# EAGLE design Atrix_adapter (EAGLE 7.2.0)
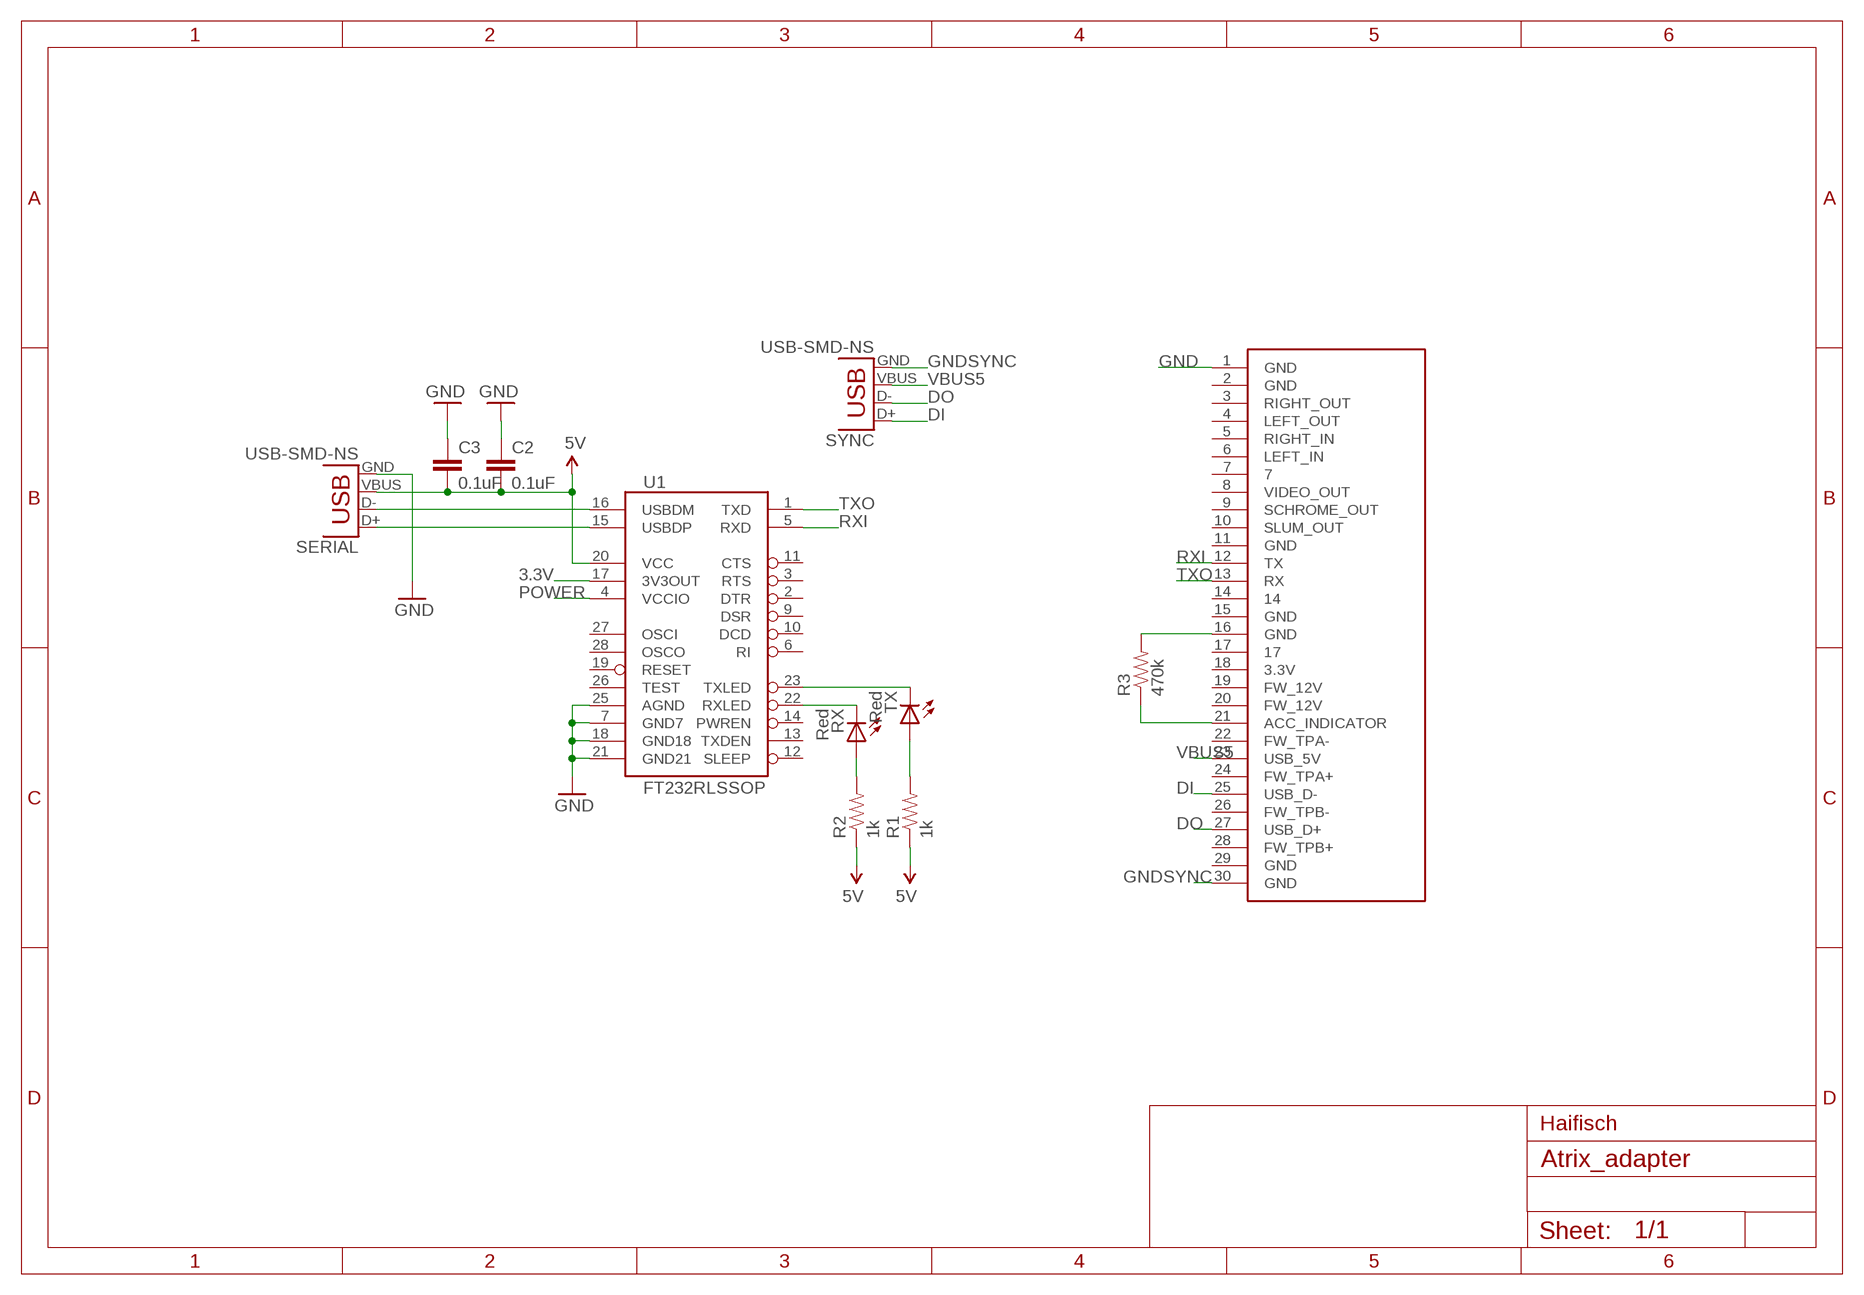
[diagram p0: schematic, sheet 1]

## Parts
C2  0.1uF  CAP0402-CAP  [0402-CAP]
C3  0.1uF  CAP0402-CAP  [0402-CAP]
R1  1k  RESISTOR0402-RES  [0402-RES]
R2  1k  RESISTOR0402-RES  [0402-RES]
R3  470k  RESISTOR0402-RES  [0402-RES]
RX  Red  LEDCHIP-LED0603  [CHIP-LED0603]
SERIAL  USB-SMD-NS  [USB-MINIB-NOSTOP]
SYNC  USB-SMD-NS  [USB-MINIB-NOSTOP]
TX  Red  LEDCHIP-LED0603  [CHIP-LED0603]
U1  FT232RLSSOP  [SSOP28DB]
U$1  IPOD_CONNECTOR_MALE  [IPOD_MALE_CONNECTOR]

## Nets
3.3V: U1.17(3V3OUT)
5V: C2.2 C3.2 R1.1 R2.1 SERIAL.VBUS U1.20(VCC)
DI: SYNC.D+ U$1.25(USB_D-)
DO: SYNC.D- U$1.27(USB_D+)
GND [power]: C2.1 C3.1 SERIAL.GND U1.7(GND7) U1.18(GND18) U1.21(GND21) U1.25(AGND) U$1.1(GND)
GNDSYNC: SYNC.GND U$1.30(GND)
N$1: R3.1 U$1.21(ACC_INDICATOR)
N$2: R3.2 U$1.16(GND)
N$9: SERIAL.D+ U1.15(USBDP)
N$10: SERIAL.D- U1.16(USBDM)
N$11: R2.2 RX.A
N$12: R1.2 TX.A
POWER: U1.4(VCCIO)
RXI: U1.5(RXD) U$1.12(TX)
RXLED: RX.C U1.22(RXLED)
TXLED: TX.C U1.23(TXLED)
TXO: U1.1(TXD) U$1.13(RX)
VBUS5: SYNC.VBUS U$1.23(USB_5V)
Unconnected: U1.2(DTR) U1.3(RTS) U1.6(RI) U1.9(DSR) U1.10(DCD) U1.11(CTS) U1.12(SLEEP) U1.13(TXDEN) U1.14(PWREN) U1.19(RESET) U1.26(TEST) U1.27(OSCI) U1.28(OSCO) U$1.2(GND) U$1.3(RIGHT_OUT) U$1.4(LEFT_OUT) U$1.5(RIGHT_IN) U$1.6(LEFT_IN) U$1.7 U$1.8(VIDEO_OUT) U$1.9(SCHROME_OUT) U$1.10(SLUM_OUT) U$1.11(GND) U$1.14 U$1.15(GND) U$1.17 U$1.18(3.3V) U$1.19(FW_12V) U$1.20(FW_12V) U$1.22(FW_TPA-) U$1.24(FW_TPA+) U$1.26(FW_TPB-) U$1.28(FW_TPB+) U$1.29(GND)

## Notes on the sheet
- Haifisch

## Library data of the parts
C2 C3 = Pinoccio:CAP: Capacitor Standard 0603 ceramic capacitor, and 0.1" leaded capacitor.
R1-R3 = Pinoccio:RESISTOR: Resistor Basic schematic elements and footprints for 0603, 1206, and PTH resistors.
RX TX = led:LED: LED OSRAM: - CHIPLED LG R971, LG N971, LY N971, LG Q971, LY Q971, LO R971, LY R971 LH N974, LH R974 LS Q976, LO Q976, LY Q976 LO Q996 - Hyper CHIPLED LW Q18S LB Q993, LB Q99A, LB R99A - SideLED LS A670, LO A670, LY A670, LG A670, LP A670 LB A673, LV A673, LT A673, LW A673 LH A674 LY A675 LS A676, LA A676, LO A676, LY A676, LW A676 LS A679, LY A679, LG A679 - Hyper Micro SIDELED® LS Y876, LA Y876, LO Y876, LY Y876 LT Y87S - SmartLED LW L88C, LW L88S LB L89C, LB L89S, LG L890 LS L89K, LO L89K, LY L89K LS L896, LA L896, LO L896, LY L896 - TOPLED LS T670, LO T670, LY T670, LG T670, LP T670 LSG T670, LSP T670, LSY T670, LOP T670, LYG T670 LG T671, LOG T671, LSG T671 LB T673, LV T673, LT T673, LW T673 LH T674 LS T676, LA T676, LO T676, LY T676, LB T676, LH T676, LSB T676, LW T676 LB T67C, LV T67C, LT T67C, LS T67K, LO T67K, LY T67K, LW E67C LS E67B, LA E67B, LO E67B, LY E67B, LB E67C, LV E67C, LT E67C LW T67C LS T679, LY T679, LG T679 LS T770, LO T770, LY T770, LG T770, LP T770 LB T773, LV T773, LT T773, LW T773 LH T774 LS E675, LA E675, LY E675, LS T675 LS T776, LA T776, LO T776, LY T776, LB T776 LHGB T686 LT T68C, LB T68C - Hyper Mini TOPLED® LB M676 - Mini TOPLED Santana® LG M470 LS M47K, LO M47K, LY M47K Source: http://www.osram.convergy.de LUXEON: - LUMILED® LXK2-PW12-R00, LXK2-PW12-S00, LXK2-PW14-U00, LXK2-PW14-V00 LXK2-PM12-R00, LXK2-PM12-S00, LXK2-PM14-U00 LXK2-PE12-Q00, LXK2-PE12-R00, LXK2-PE12-S00, LXK2-PE14-T00, LXK2-PE14-U00 LXK2-PB12-K00, LXK2-PB12-L00, LXK2-PB12-M00, LXK2-PB14-N00, LXK2-PB14-P00, LXK2-PB14-Q00 LXK2-PR12-L00, LXK2-PR12-M00, LXK2-PR14-Q00, LXK2-PR14-R00 LXK2-PD12-Q00, LXK2-PD12-R00, LXK2-PD12-S00 LXK2-PH12-R00, LXK2-PH12-S00 LXK2-PL12-P00, LXK2-PL12-Q00, LXK2-PL12-R00 Source: www.luxeon.com KINGBRIGHT: KA-3528ASYC Source: www.kingbright.com
SERIAL SYNC = SparkFun-Connectors:USB: USB Connectors USB-B-PTH is fully proven SKU : PRT-00139/CONN-08278 USB-miniB is fully proven SKU : PRT-00587 USB-A-PCB is untested. USB-A-H is throughly reviewed, but untested. Spark Fun Electronics SKU : PRT-00437 USB-B-SMT is throughly reviewed, but untested. Needs silkscreen touching up. USB-A-S has not been used/tested USB-MB-H has not been used/tested USB-MICROB has been used. CONN-09505
U1 = SparkFun-DigitalIC:FT232RL: USB UART FT232RL 4th Generation USB UART (USB <-> Serial) Controller. Spark Fun Electronics SKU : COM-00650 Production SKU IC-00870; PROD_ID: IC-00870
U$1 = SparkFun-Connectors:IPOD_CONNECTOR_MALE: iPod Male Connector This is the connector that will insert into an iPods. Use this connector to gain access to the various iPod pins. Schematic and footprint are not yet production proven. The PCB thickness must be more thin than the standard 0.062" FR4. Spark Fun Electronics SKU : DEV-00633

## Net classes
1 power: width 0.254 mm

## Board
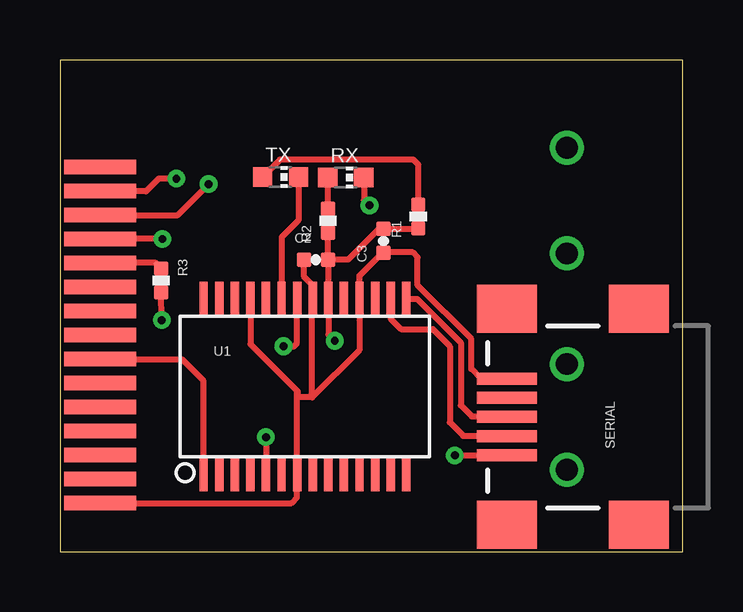
[diagram p1: board, top side]
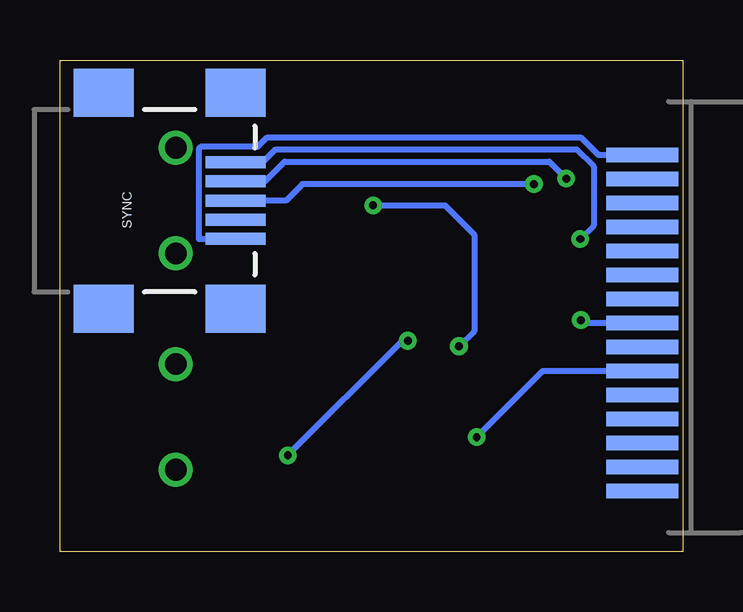
[diagram p2: board, bottom side, seen from below]

Size 25.96 x 20.5 mm. Coordinates in mm from the lower left corner, seen from the top.
Outline: 0,0 25.96,0 25.96,20.5 0,20.5 0,0
Copper layers (1*16): Top 0.035mm / dielectric 1.5mm / Bottom 0.035mm
Design rules "default": minimum track width 10mil, minimum drill 24mil, track to track 8mil, track to pad 8mil, pad to pad 8mil, via to via 8mil, smd to smd 8mil, copper to edge 40mil, drill to drill 8mil, minimum pad ring 10mil, minimum via ring 8mil, stop-mask expansion 4mil, vias tented up to drill 0mil, thermal gap 10mil

### Footprints (pad centres in the part's own frame; a part is rotated, then mirrored left to right if it is on the bottom)
0402-CAP = smd 0.6 x 0.6: 1 -0.5,0; 2 0.5,0
0402-RES = smd 0.6 x 0.6: 1 -0.5,0; 2 0.5,0
CHIP-LED0603 = smd 0.8 x 0.8: A 0,-0.75; C 0,0.75
USB-MINIB-NOSTOP = smd 2.5 x 0.5: D+ 2.5,0; D- 2.5,0.8; GND 2.5,-1.6; ID 2.5,-0.8; VBUS 2.5,1.6 | smd 2.5 x 2: G1 -3,-4.5; G2 -3,4.5; G3 2.5,4.5; G4 2.5,-4.5 | drill 0.9 pad 0.8: H1 0,2.2 | drill 0.9 pad 0.787: H2 0,-2.2
SSOP28DB = smd 0.348 x 1.397: 1 -4.225,-3.656; 2 -3.575,-3.656; 3 -2.925,-3.656; 4 -2.275,-3.656; 5 -1.625,-3.656; 6 -0.975,-3.656; 7 -0.325,-3.656; 8 0.325,-3.656; 9 0.975,-3.656; 10 1.625,-3.656; 11 2.275,-3.656; 12 2.925,-3.656; 13 3.575,-3.656; 14 4.225,-3.656; 15 4.225,3.656; 16 3.575,3.656; 17 2.925,3.656; 18 2.275,3.656; 19 1.625,3.656; 20 0.975,3.656; 21 0.325,3.656; 22 -0.325,3.656; 23 -0.975,3.656; 24 -1.625,3.656; 25 -2.275,3.656; 26 -2.925,3.656; 27 -3.575,3.656; 28 -4.225,3.656
IPOD_MALE_CONNECTOR = smd 0.6 x 3 bottom: 1 7.5,0; 3 6.5,0; 5 5.5,0; 7 4.5,0; 9 3.5,0; 11 2.5,0; 13 1.5,0; 15 0.5,0; 17 -0.5,0; 19 -1.5,0; 21 -2.5,0; 23 -3.5,0; 25 -4.5,0; 27 -5.5,0; 29 -6.5,0 | smd 0.6 x 3: 2 7,0; 4 6,0; 6 5,0; 8 4,0; 10 3,0; 12 2,0; 14 1,0; 16 0,0; 18 -1,0; 20 -2,0; 22 -3,0; 24 -4,0; 26 -5,0; 28 -6,0; 30 -7,0

### Placement (x,y rotation side)
C2  10.67,12.17 0 top
C3  13.49,12.96 90 top
R1  14.94,13.98 90 top
R2  11.18,13.8 90 top
R3  4.22,11.31 270 top
RX  11.92,15.6 270 top
SERIAL  21.14,5.62 180 top
SYNC  21.14,14.64 0 bottom
TX  9.19,15.62 270 top
U1  10.21,6.89 0 top
U$1  1.68,9.53 270 bottom

### Tracks (layer width: path | path; a pad name or v marks a point on that pad's centre or on a via)
5V  (via drill 0.33)
  Top 0.254: C2.2 11.19,12.16 U1.20 11.19,9.07 v11.46,8.8 | C2.2 11.17,13.29 R2.1 | C2.2 12.02,12.17 13.31,13.46 C3.2 14.92,13.46 R1.1 | v16.46,4.02 SERIAL.VBUS | SERIAL.VBUS
  Bottom 0.254: v11.46,8.8 11.69,8.8 v16.46,4.02
DI  (via drill 0.33)
  Top 0.254: U$1.25 4.91,14.03 v6.2,15.32
  Bottom 0.254: v6.2,15.32 15.85,15.32 16.54,14.64 SYNC.D+
DO  (via drill 0.33)
  Top 0.254: v4.85,15.55 4.12,15.55 3.58,15.02 1.69,15.02 U$1.27
  Bottom 0.254: SYNC.D- 17.42,15.44 16.59,16.26 5.57,16.26 v4.85,15.55
GND
  Top 0.254: C2.1 10.16,11.49 10.54,11.11 U1.21 10.52,10.53 10.52,6.43 | U1.25 7.94,8.66 9.91,6.69 | 9.91,6.69 9.91,6.43 10.52,6.43 | 9.91,3.26 U1.7 | 10.52,6.43 12.49,8.4 U1.18 12.47,10.56 12.47,11.49 13.45,12.46 C3.1 13.51,12.48 14.71,12.48 14.91,12.28 14.91,11.11 17.15,8.87 17.15,7.63 17.56,7.22 SERIAL.GND | U$1.1 9.65,2.03 9.88,2.27 U1.7 | U1.7 9.89,6.67 9.91,6.69
GNDSYNC
  Bottom 0.254: U$1.30 3.5,16.53 4.22,17.25 17.35,17.25 17.73,16.87 20.09,16.87 20.17,16.8 20.17,13.04 SYNC.GND | SYNC.GND
N$1
  Top 0.254: U$1.21 1.71,12.06 3.97,12.06 R3.1
N$2  (via drill 0.33)
  Top 0.254: v4.25,9.66 R3.2
  Bottom 0.254: U$1.16 4.12,9.53 v4.25,9.66
N$9
  Top 0.254: U1.15 14.89,10.55 16.72,8.72 16.72,6.1 17.17,5.65 18.61,5.65 SERIAL.D+
N$10
  Top 0.254: U1.16 13.79,9.72 14.23,9.28 15.55,9.28 16.26,8.57 16.26,5.39 16.82,4.83 18.62,4.83 SERIAL.D-
N$11
  Top 0.254: R2.2 RX.A
N$12
  Top 0.254: R1.2 14.94,16.14 14.74,16.34 9.17,16.34 TX.A
RXI  (via drill 0.33)
  Top 0.254: v8.59,4.78 U1.5
  Bottom 0.254: U$1.12 5.84,7.53 v8.59,4.78
RXLED  (via drill 0.33)
  Top 0.254: RX.C 12.67,14.67 v12.91,14.43 | v9.33,8.57 9.76,8.57 9.88,8.69 U1.22
  Bottom 0.254: v12.91,14.43 9.91,14.43 8.69,13.22 8.69,9.2 v9.33,8.57
TXLED
  Top 0.254: TX.C 9.94,13.81 9.25,13.11 U1.23
TXO
  Top 0.254: U1.1 5.99,7.13 5.11,8.01 1.7,8.01 U$1.13
VBUS5  (via drill 0.33)
  Top 0.254: v4.27,13.04 U$1.23
  Bottom 0.254: SYNC.VBUS 17.5,16.24 16.97,16.77 4.42,16.77 3.71,16.06 3.71,13.6 v4.27,13.04